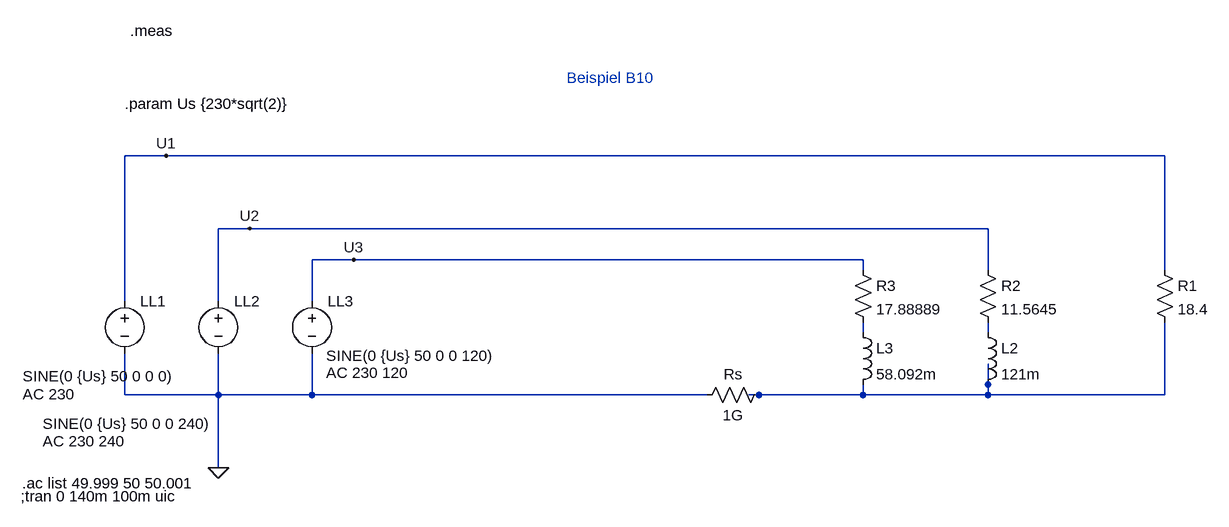
[diagram p0: schematic RepET_Drehstrom3Phasennetz.asc]
RepET_Drehstrom3Phasennetz.asc, the LTspice schematic file:
Version 4
SHEET 1 1420 680
WIRE -192 16 -256 16
WIRE 1344 16 -192 16
WIRE -64 128 -112 128
WIRE 1072 128 -64 128
WIRE 96 176 32 176
WIRE 880 176 96 176
WIRE 880 192 880 176
WIRE 1072 192 1072 128
WIRE 1344 192 1344 16
WIRE -256 240 -256 16
WIRE -112 240 -112 128
WIRE 32 240 32 176
WIRE 880 288 880 272
WIRE 1072 288 1072 272
WIRE 1072 368 1072 336
WIRE -256 384 -256 320
WIRE -112 384 -112 320
WIRE -112 384 -256 384
WIRE 32 384 32 320
WIRE 32 384 -112 384
WIRE 640 384 32 384
WIRE 720 384 704 384
WIRE 880 384 880 368
WIRE 880 384 720 384
WIRE 1072 384 1072 368
WIRE 1072 384 880 384
WIRE 1344 384 1344 272
WIRE 1344 384 1072 384
WIRE -112 496 -112 384
FLAG -112 496 0
FLAG -192 16 U1
FLAG -64 128 U2
FLAG 96 176 U3
SYMBOL voltage -256 224 R0
WINDOW 3 -157 131 Left 2
WINDOW 123 -157 159 Left 2
WINDOW 39 0 0 Left 0
SYMATTR InstName LL1
SYMATTR Value SINE(0 {Us} 50 0 0 0)
SYMATTR Value2 AC 230
SYMBOL voltage -112 224 R0
WINDOW 3 -270 204 Left 2
WINDOW 123 -270 231 Left 2
WINDOW 39 0 0 Left 0
SYMATTR InstName LL2
SYMATTR Value SINE(0 {Us} 50 0 0 240)
SYMATTR Value2 AC 230 240
SYMBOL voltage 32 224 R0
WINDOW 3 22 100 Left 2
WINDOW 123 22 126 Left 2
WINDOW 39 0 0 Left 0
SYMATTR InstName LL3
SYMATTR Value SINE(0 {Us} 50 0 0 120)
SYMATTR Value2 AC 230 120
SYMBOL res 864 176 R0
SYMATTR InstName R3
SYMATTR Value 17.88889
SYMBOL ind 864 272 R0
SYMATTR InstName L3
SYMATTR Value 58.092m
SYMBOL res 1056 176 R0
SYMATTR InstName R2
SYMATTR Value 11.5645
SYMBOL ind 1056 272 R0
SYMATTR InstName L2
SYMATTR Value 121m
SYMBOL res 1328 176 R0
SYMATTR InstName R1
SYMATTR Value 18.4
SYMBOL res 736 368 R90
WINDOW 0 0 56 VBottom 2
WINDOW 3 32 56 VTop 2
SYMATTR InstName Rs
SYMATTR Value 1G
TEXT 424 -104 Left 2 ;Beispiel B10
TEXT -256 -64 Left 2 !.param Us {230*sqrt(2)}
TEXT -414 520 Left 2 !.ac list 49.999 50 50.001
TEXT -416 540 Left 2 !;tran 0 140m 100m uic
TEXT -248 -176 Left 2 !.meas

The netlist it stands for:
* RepET_Drehstrom3Phasennetz.asc
V§LL1 U1 0 SINE(0 {Us} 50 0 0 0) AC 230
V§LL2 U2 0 SINE(0 {Us} 50 0 0 240) AC 230 240
V§LL3 U3 0 SINE(0 {Us} 50 0 0 120) AC 230 120
R3 U3 N001 17.88889
L3 N001 N003 58.092m
R2 U2 N002 11.5645
L2 N002 N003 121m
R1 U1 N003 18.4
Rs N003 0 1G
* Beispiel B10
.param Us {230*sqrt(2)}
.ac list 49.999 50 50.001
;tran 0 140m 100m uic
.meas
.backanno
.end